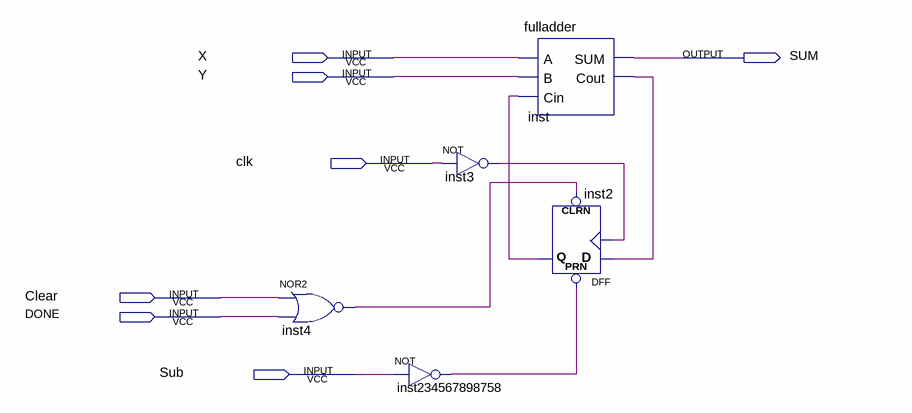
[diagram p0: schematic sheet]
// Quartus schematic serialadder.bdf as structural Verilog: 5 symbols, 7 pins
module serialadder (
  input  X,
  input  Y,
  input  clk,
  input  Clear,
  input  DONE,
  input  Sub,
  output SUM
);

  wire inst2_q, inst3_out, inst4_out, inst234567898758_out, inst_cout;

  nor inst4 (inst4_out, Clear, DONE);
  not inst234567898758 (inst234567898758_out, Sub);
  not inst3 (inst3_out, clk);
  fulladder inst (.A(X), .B(Y), .Cin(inst2_q), .SUM(SUM), .Cout(inst_cout));
  DFF inst2 (.CLRN(inst4_out), .CLK(inst3_out), .D(inst_cout), .PRN(inst234567898758_out), .Q(inst2_q));
endmodule
